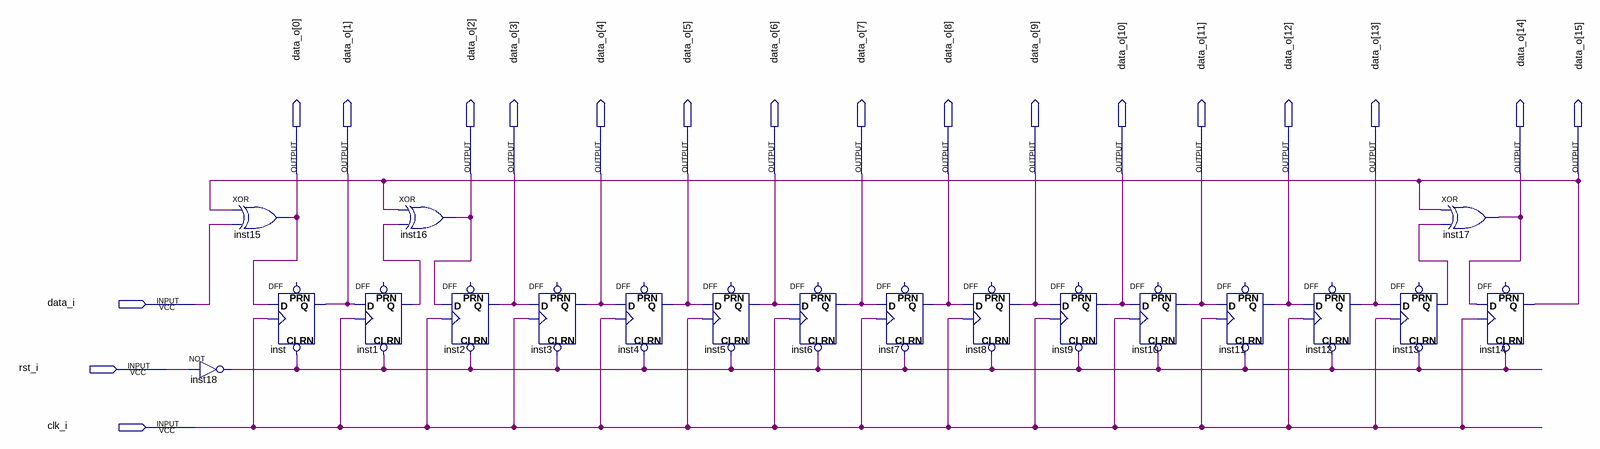
[diagram p0: schematic sheet]
// Quartus schematic crc_16_ansi.bdf as structural Verilog: 19 symbols, 19 pins
module crc_16_ansi (
  input  data_i,
  input  rst_i,
  input  clk_i,
  output [15:0] data_o
);

  wire inst1_q, inst13_q, inst18_out;

  not inst18 (inst18_out, rst_i);
  xor inst15 (data_o[0], data_o[15], data_i);
  DFF inst (.CLRN(inst18_out), .CLK(clk_i), .D(data_o[0]), .Q(data_o[1]));  // open: PRN
  xor inst16 (data_o[2], data_o[15], inst1_q);
  DFF inst1 (.CLRN(inst18_out), .CLK(clk_i), .D(data_o[1]), .Q(inst1_q));  // open: PRN
  DFF inst2 (.CLRN(inst18_out), .CLK(clk_i), .D(data_o[2]), .Q(data_o[3]));  // open: PRN
  DFF inst3 (.CLRN(inst18_out), .CLK(clk_i), .D(data_o[3]), .Q(data_o[4]));  // open: PRN
  DFF inst4 (.CLRN(inst18_out), .CLK(clk_i), .D(data_o[4]), .Q(data_o[5]));  // open: PRN
  DFF inst5 (.CLRN(inst18_out), .CLK(clk_i), .D(data_o[5]), .Q(data_o[6]));  // open: PRN
  DFF inst6 (.CLRN(inst18_out), .CLK(clk_i), .D(data_o[6]), .Q(data_o[7]));  // open: PRN
  DFF inst7 (.CLRN(inst18_out), .CLK(clk_i), .D(data_o[7]), .Q(data_o[8]));  // open: PRN
  DFF inst8 (.CLRN(inst18_out), .CLK(clk_i), .D(data_o[8]), .Q(data_o[9]));  // open: PRN
  DFF inst9 (.CLRN(inst18_out), .CLK(clk_i), .D(data_o[9]), .Q(data_o[10]));  // open: PRN
  DFF inst10 (.CLRN(inst18_out), .CLK(clk_i), .D(data_o[10]), .Q(data_o[11]));  // open: PRN
  DFF inst11 (.CLRN(inst18_out), .CLK(clk_i), .D(data_o[11]), .Q(data_o[12]));  // open: PRN
  DFF inst12 (.CLRN(inst18_out), .CLK(clk_i), .D(data_o[12]), .Q(data_o[13]));  // open: PRN
  xor inst17 (data_o[14], data_o[15], inst13_q);
  DFF inst13 (.CLRN(inst18_out), .CLK(clk_i), .D(data_o[13]), .Q(inst13_q));  // open: PRN
  DFF inst14 (.CLRN(inst18_out), .CLK(clk_i), .D(data_o[14]), .Q(data_o[15]));  // open: PRN
endmodule
